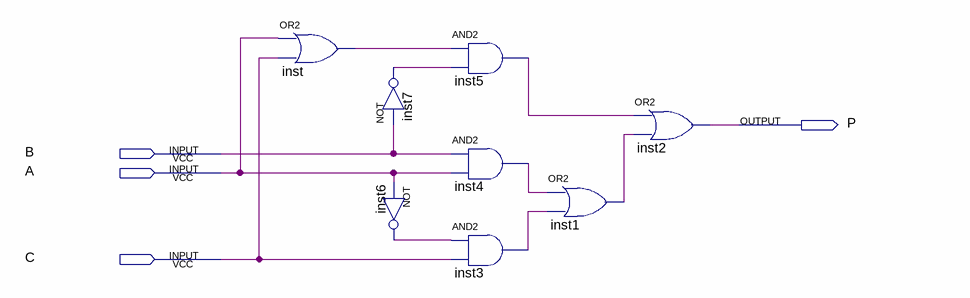
[diagram p0: schematic sheet]
// Quartus schematic The_Or_Circuit.bdf as structural Verilog: 8 symbols, 4 pins
module The_Or_Circuit (
  input  B,
  input  A,
  input  C,
  output P
);

  wire inst1_out, inst3_out, inst4_out, inst5_out, inst6_out, inst7_out, inst_out;

  or inst (inst_out, A, C);
  not inst7 (inst7_out, B);
  not inst6 (inst6_out, A);
  and inst5 (inst5_out, inst_out, inst7_out);
  and inst4 (inst4_out, B, A);
  and inst3 (inst3_out, inst6_out, C);
  or inst1 (inst1_out, inst4_out, inst3_out);
  or inst2 (P, inst5_out, inst1_out);
endmodule
